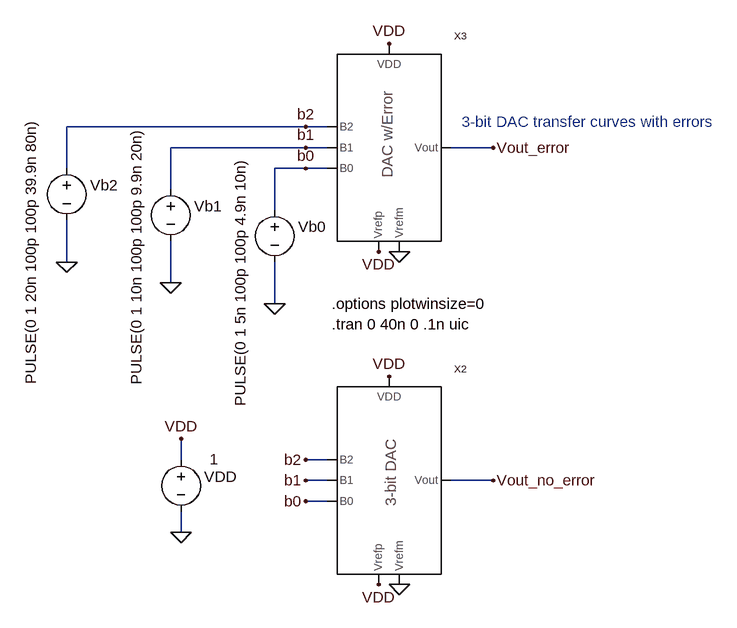
[diagram p0: schematic Fig28_11.asc]
Fig28_11.asc, the LTspice schematic file:
Version 4
SHEET 1 1920 968
WIRE 688 128 320 128
WIRE 720 128 688 128
WIRE 688 160 480 160
WIRE 720 160 688 160
WIRE 976 160 912 160
WIRE 320 192 320 128
WIRE 688 192 640 192
WIRE 720 192 688 192
WIRE 480 224 480 160
WIRE 640 256 640 192
WIRE 320 336 320 272
WIRE 480 368 480 304
WIRE 640 400 640 336
WIRE 496 640 496 608
WIRE 720 640 688 640
WIRE 720 672 688 672
WIRE 976 672 912 672
WIRE 720 704 688 704
WIRE 496 752 496 720
FLAG 640 400 0
FLAG 976 160 Vout_error
FLAG 832 320 0
FLAG 800 320 VDD
FLAG 816 0 VDD
FLAG 480 368 0
FLAG 320 336 0
FLAG 496 752 0
FLAG 496 608 VDD
FLAG 688 192 b0
FLAG 688 160 b1
FLAG 688 128 b2
FLAG 976 672 Vout_no_error
FLAG 832 832 0
FLAG 800 832 VDD
FLAG 816 512 VDD
FLAG 688 704 b0
FLAG 688 672 b1
FLAG 688 640 b2
SYMBOL voltage 640 240 R0
WINDOW 0 36 42 Left 0
WINDOW 3 -53 318 VLeft 0
WINDOW 123 0 0 Left 0
WINDOW 39 0 0 Left 0
SYMATTR InstName Vb0
SYMATTR Value PULSE(0 1 5n 100p 100p 4.9n 10n)
SYMBOL voltage 480 208 R0
WINDOW 0 36 42 Left 0
WINDOW 3 -53 317 VLeft 0
WINDOW 123 0 0 Left 0
WINDOW 39 0 0 Left 0
SYMATTR InstName Vb1
SYMATTR Value PULSE(0 1 10n 100p 100p 9.9n 20n)
SYMBOL voltage 320 176 R0
WINDOW 0 36 42 Left 0
WINDOW 3 -55 348 VLeft 0
WINDOW 123 0 0 Left 0
WINDOW 39 0 0 Left 0
SYMATTR InstName Vb2
SYMATTR Value PULSE(0 1 20n 100p 100p 39.9n 80n)
SYMBOL voltage 496 624 R0
WINDOW 0 36 42 Left 0
WINDOW 3 44 15 Left 0
WINDOW 123 0 0 Left 0
WINDOW 39 0 0 Left 0
SYMATTR InstName VDD
SYMATTR Value 1
SYMBOL Error_3_bit_DAC 736 304 R0
SYMATTR InstName X3
SYMBOL Ideal_3_bit_DAC 736 816 R0
SYMATTR InstName X2
TEXT 728 432 Left 0 !.tran 0 40n 0 .1n uic
TEXT 728 400 Left 0 !.options plotwinsize=0
TEXT 928 120 Left 0 ;3-bit DAC transfer curves with errors

The netlist it stands for:
* Fig28_11.asc
Vb0 b0 0 PULSE(0 1 5n 100p 100p 4.9n 10n)
Vb1 b1 0 PULSE(0 1 10n 100p 100p 9.9n 20n)
Vb2 b2 0 PULSE(0 1 20n 100p 100p 39.9n 80n)
VDD VDD 0 1
XX3 b2 b1 b0 Vout_error VDD 0 VDD Error_3_bit_DAC  ; pins B2 B1 B0 Vout Vrefp Vrefm VDD
XX2 b2 b1 b0 Vout_no_error VDD 0 VDD Ideal_3_bit_DAC  ; pins B2 B1 B0 Vout Vrefp Vrefm VDD
.tran 0 40n 0 .1n uic
.options plotwinsize=0
* 3-bit DAC transfer curves with errors
.backanno
.end